# EAGLE design 9DOF-Razor-v22 (EAGLE 6.1)

## Sheet 1 of 2
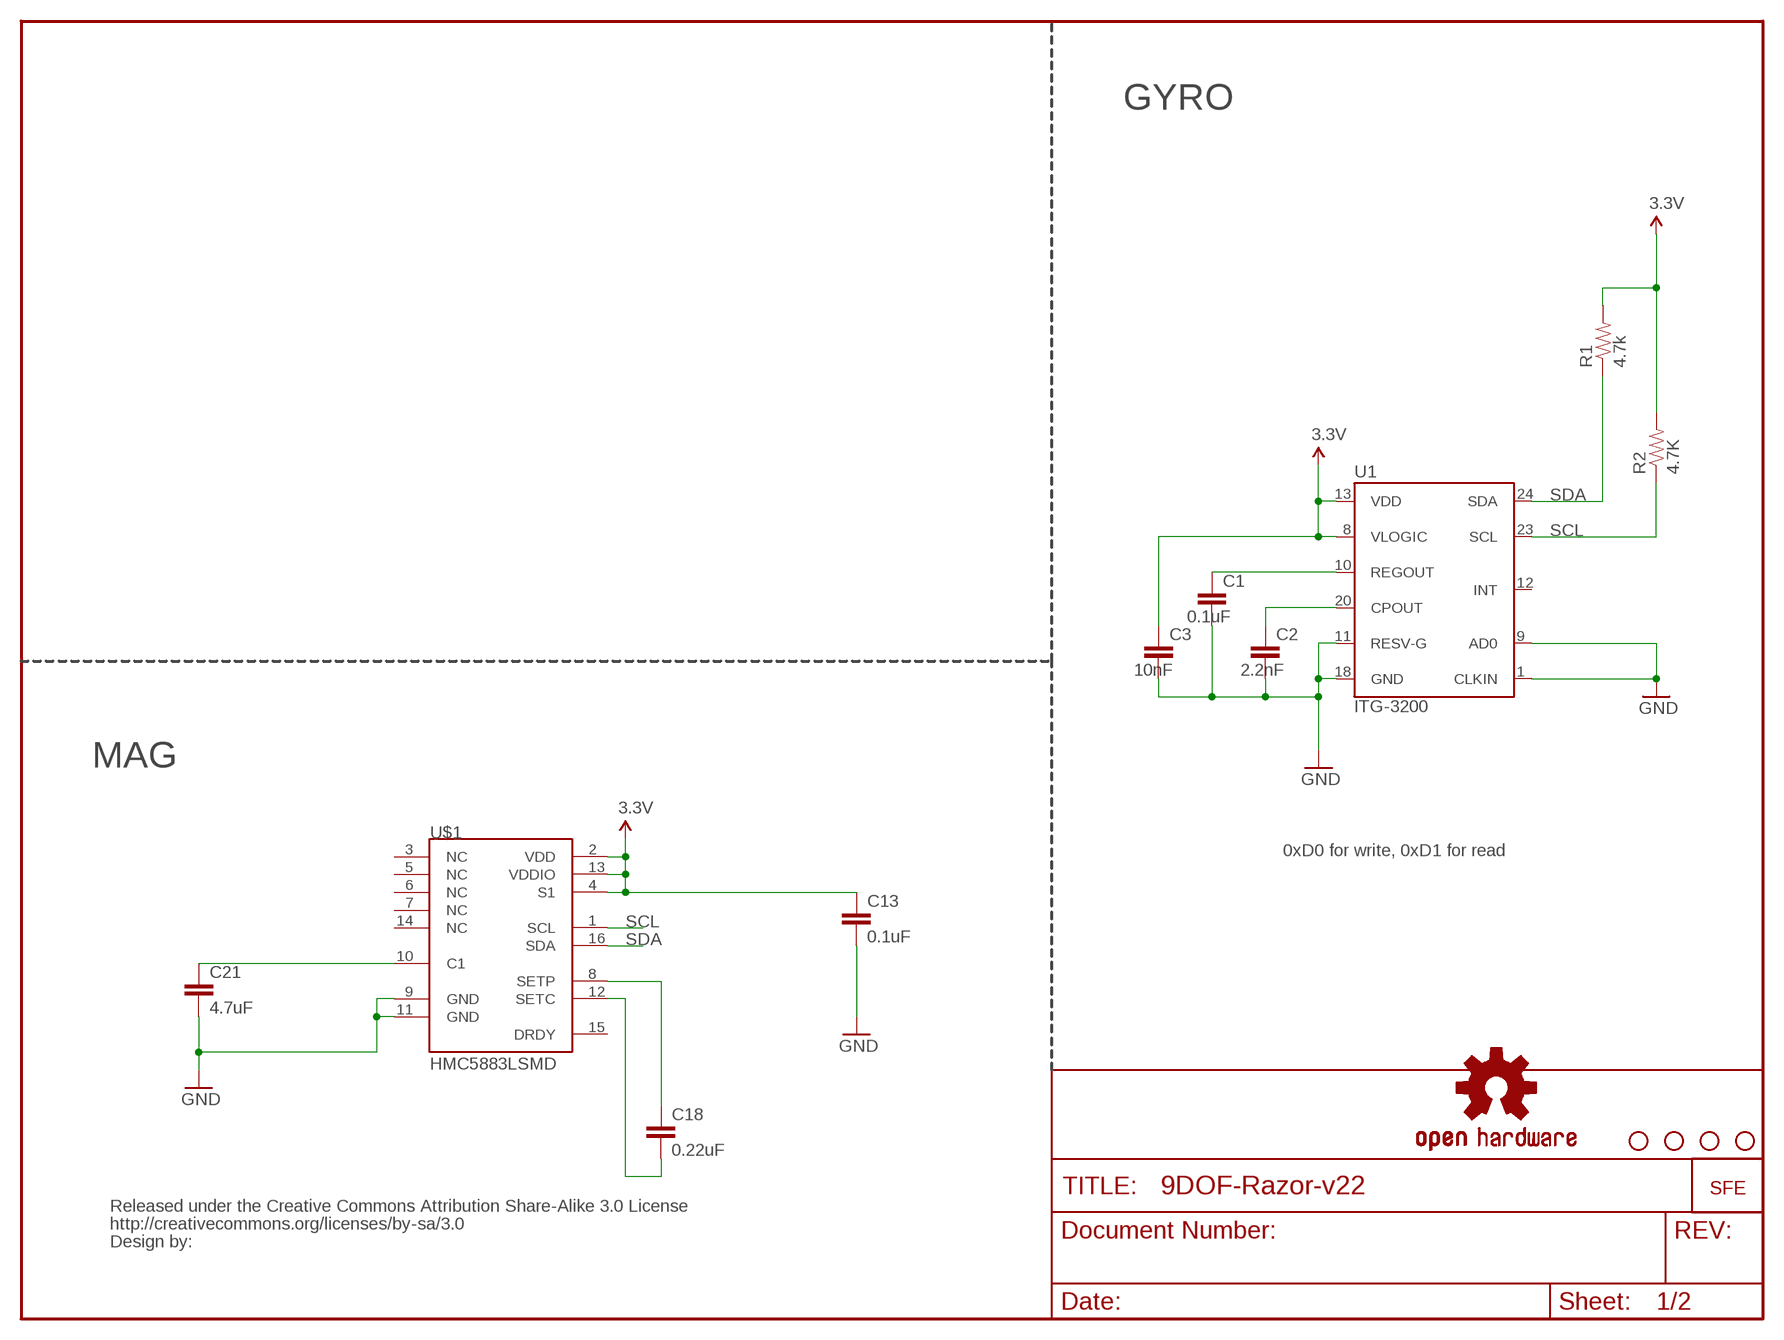
[diagram p0: schematic, sheet 1]

### Parts
C1  0.1uF  CAP0402-CAP  [0402-CAP]
C2  2.2nF  CAP0402-CAP  [0402-CAP]
C3  10nF  CAP0402-CAP  [0402-CAP]
C13  0.1uF  CAP0402-CAP  [0402-CAP]
C18  0.22uF  CAP0402-CAP  [0402-CAP]
C21  4.7uF  CAP0402-CAP  [0402-CAP]
JP2  STAND-OFF  [STAND-OFF]
JP3  LOGO-SFENEW  [SFE-NEW-WEBLOGO]
JP4  STAND-OFF  [STAND-OFF]
JP5  STAND-OFF  [STAND-OFF]
JP6  STAND-OFF  [STAND-OFF]
R1  4.7k  RESISTOR0402-RES  [0402-RES]
R2  4.7K  RESISTOR0402-RES  [0402-RES]
U1  ITG-3200  [QFN-24]
U$1  HMC5883LSMD  [16LPCC]
U$2  CREATIVE_COMMONS  [CREATIVE_COMMONS]
U$4  OSHW-LOGOL  [OSHW-LOGO-L]

### Nets
3.3V: C3.1 C13.1 R1.2 R2.2 U1.8(VLOGIC) U1.13(VDD) U$1.2(VDD) U$1.4(S1) U$1.13(VDDIO) ; also sheet 2
GND: C1.2 C2.2 C3.2 C13.2 C21.2 U1.1(CLKIN) U1.9(AD0) U1.11(RESV-G) U1.18(GND) U$1.9(GND) U$1.11(GND) ; also sheet 2
N$1: C18.2 U$1.8(SETP)
N$2: C18.1 U$1.12(SETC)
N$3: C1.1 U1.10(REGOUT)
N$4: C2.1 U1.20(CPOUT)
N$6: C21.1 U$1.10(C1)
SCL: R2.1 U1.23(SCL) U$1.1(SCL) ; also sheet 2
SDA: R1.1 U1.24(SDA) U$1.16(SDA) ; also sheet 2
Unconnected: U1.12(INT) U$1.3(NC) U$1.5(NC) U$1.6(NC) U$1.7(NC) U$1.14(NC) U$1.15(DRDY)

### Notes on the sheet
- GYRO
- MAG
- 0xD0 for write, 0xD1 for read

## Sheet 2 of 2
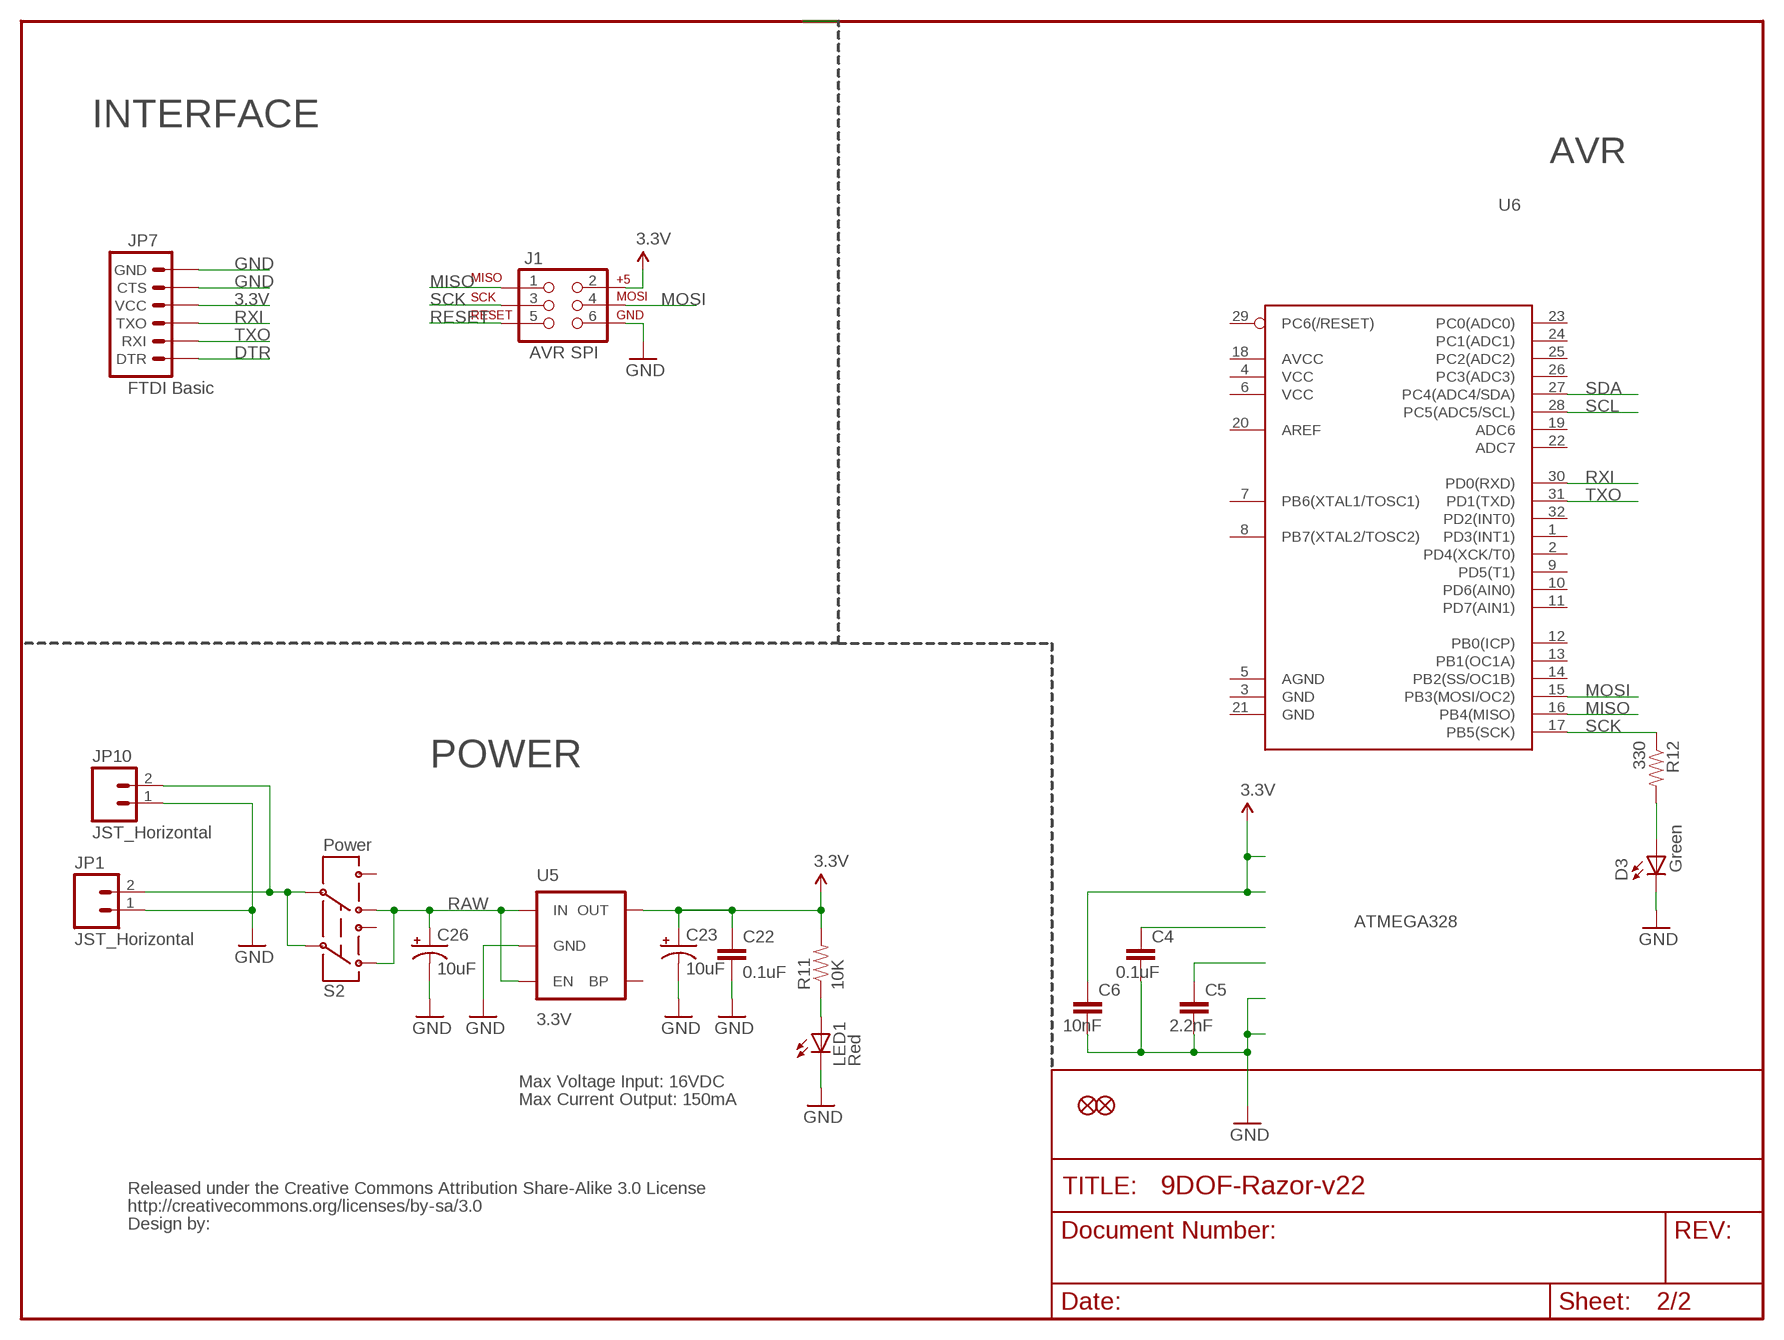
[diagram p1: schematic, sheet 2]

### Parts
C4  0.1uF  CAP0402-CAP  [0402-CAP]
C5  2.2nF  CAP0402-CAP  [0402-CAP]
C6  10nF  CAP0402-CAP  [0402-CAP]
C22  0.1uF  CAP0402-CAP  [0402-CAP]
C23  10uF  CAP_POL1206  [EIA3216]
C26  10uF  CAP_POL1206  [EIA3216]
D3  Green  LED0603  [LED-0603]
J1  AVR_SPI_PRG_6PTH  [2X3]
JP1  JST_Horizontal  M02-JST-2MM-SMT  [JST-2-SMD]
JP7  FTDI Basic  ARDUINO_SERIAL_PROGRAMPTH  [1X06]
JP10  JST_Horizontal  M02PTH  [1X02]
JP11  FIDUCIAL1X2.5  [FIDUCIAL-1X2.5]
JP12  FIDUCIAL1X2.5  [FIDUCIAL-1X2.5]
LED1  Red  LED0603  [LED-0603]
R11  10K  RESISTOR0402-RES  [0402-RES]
R12  330  RESISTOR0402-RES  [0402-RES]
S2  Power  SWITCH-DPDTSMD  [AYZ0202]
U5  3.3V  V_REG_LDOSMD  [SOT23-5]
U6  ATMEGA328  ATMEGA168  [TQFP32-08]
U$3  CREATIVE_COMMONS  [CREATIVE_COMMONS]

### Nets
3.3V: C6.1 C22.1 C23.A(+) J1.2 JP7.4(VCC) R11.2 U5.5(OUT) ; also sheet 1
DTR: JP7.1(DTR)
GND: C4.2 C5.2 C6.2 C22.2 C23.C(-) C26.C(-) D3.C J1.6 JP1.1 JP7.5(CTS) JP7.6(GND) JP10.1 LED1.C U5.2(GND) ; also sheet 1
MISO: J1.1 U6.16(PB4(MISO))
MOSI: J1.4 U6.15(PB3(MOSI/OC2))
N$5: C4.1
N$8: C5.1
N$12: D3.A R12.2
N$15: JP1.2 JP10.2 S2.2 S2.5
N$38: LED1.A R11.1
RAW [vcc]: C26.A(+) S2.1 S2.4 U5.1(IN) U5.3(EN)
RESET: J1.5
RXI: JP7.3(TXO) U6.30(PD0(RXD))
SCK: J1.3 R12.1 U6.17(PB5(SCK))
SCL: U6.28(PC5(ADC5/SCL)) ; also sheet 1
SDA: U6.27(PC4(ADC4/SDA)) ; also sheet 1
TXO: JP7.2(RXI) U6.31(PD1(TXD))
Unconnected: S2.3 S2.6 U5.4(BP) U6.1(PD3(INT1)) U6.2(PD4(XCK/T0)) U6.3(GND) U6.4(VCC) U6.5(AGND) U6.6(VCC) U6.7(PB6(XTAL1/TOSC1)) U6.8(PB7(XTAL2/TOSC2)) U6.9(PD5(T1)) U6.10(PD6(AIN0)) U6.11(PD7(AIN1)) U6.12(PB0(ICP)) U6.13(PB1(OC1A)) U6.14(PB2(SS/OC1B)) U6.18(AVCC) U6.19(ADC6) U6.20(AREF) U6.21(GND) U6.22(ADC7) U6.23(PC0(ADC0)) U6.24(PC1(ADC1)) U6.25(PC2(ADC2)) U6.26(PC3(ADC3)) U6.29(PC6(/RESET)) U6.32(PD2(INT0))

### Notes on the sheet
- INTERFACE
- AVR
- AVR SPI
- POWER
- Max Voltage Input: 16VDC
- Max Current Output: 150mA

## Library data of the parts
C1-C6 C13 C18 C21 C22 = SparkFun:CAP: Capacitor Standard 0603 ceramic capacitor, and 0.1" leaded capacitor.
C23 C26 = SparkFun:CAP_POL: Capacitor Polarized These are standard SMD and PTH capacitors. Normally 10uF, 47uF, and 100uF in electrolytic and tantalum varieties. Always verify the external diameter of the through hole cap, it varies with capacity, voltage, and manufacturer. The EIA devices should be standard.
D3 LED1 = SparkFun:LED: LEDs Standard schematic elements and footprints for 5mm, 3mm, 1206, and 0603 sized LEDs. 5mm - Spark Fun Electronics SKU : COM-00529 (and others)
J1 = SparkFun:AVR_SPI_PRG_6: AVR ISP 6 Pin This is the reduced ISP connector for AVR programming. Common on Arduino. This footprint will take up less PCB space and can be used with a 10-pin to 6-pin adapter such as SKU: BOB-08508
JP1 JP10 = SparkFun:M02: Header 2 Standard 2-pin 0.1" header. Use with straight break away headers (SKU : PRT-00116), right angle break away headers (PRT-00553), swiss pins (PRT-00743), machine pins (PRT-00117), and female headers (PRT-00115). Molex polarized connector foot print use with SKU : PRT-08233 with associated crimp pins and housings.
JP2 JP4-JP6 = SparkFun:STAND-OFF: Stand Off This is the mechanical footprint for a #4 phillips button head screw. Use the keepout ring to avoid running the screw head into surrounding components. SKU : PRT-00447
JP3 = SparkFun:LOGO-SFE: Spark Fun Electronics PCB Logo This is the standard Spark Fun Electronics PCB logo.
JP7 = SparkFun:ARDUINO_SERIAL_PROGRAM
JP11 JP12 = abes:FIDUCIAL: Fiducial Alignment Points Various fiducial points for machine vision alignment.
R1 R2 R11 R12 = SparkFun:RESISTOR: Resistor Basic schematic elements and footprints for 0603, 1206, and PTH resistors.
S2 = SparkFun:SWITCH-DPDT: DPDT Version of the COM-00597
U1 = SparkFun:ITG-3200: ITG-3200 3-axis gyro, digital output, qfn24 package
U5 = SparkFun:V_REG_LDO: Voltage Regulator LDO Standard 150mA LDO voltage regulator in SOT-23 layout. Micrel part MIC5205. BP (by-pass) pin is used to lower output noise with 470pF cap.
U6 = SparkFun:ATMEGA168
U$1 = SparkFun:HMC5883L: 3 Axis Digital Compass IC
U$2 U$3 = SparkFun:CREATIVE_COMMONS
U$4 = SparkFun:OSHW-LOGO: Open Source Hardware Logo This logo indicates the piece of hardware it is found on incorporates a OSHW license and/or adheres to the definition of open source hardware found here: http://freedomdefined.org/OSHW

## Net classes
1 vcc: width 0.254 mm

## Board
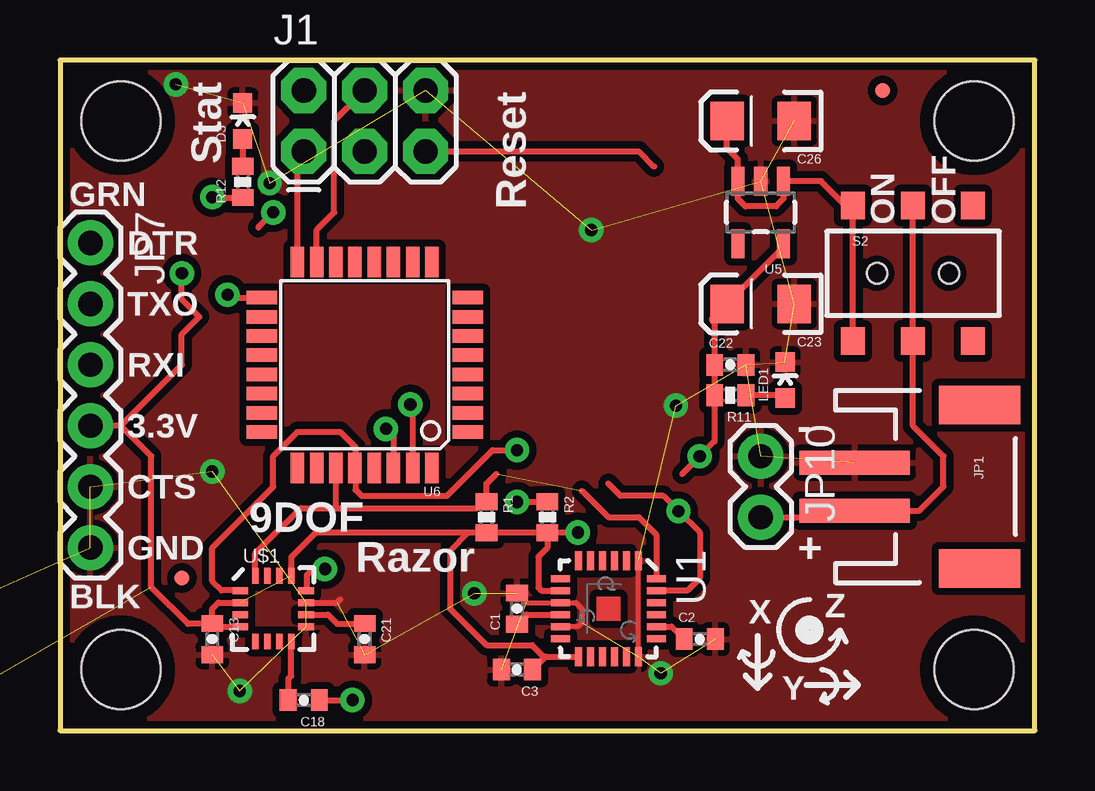
[diagram p2: board, top side]
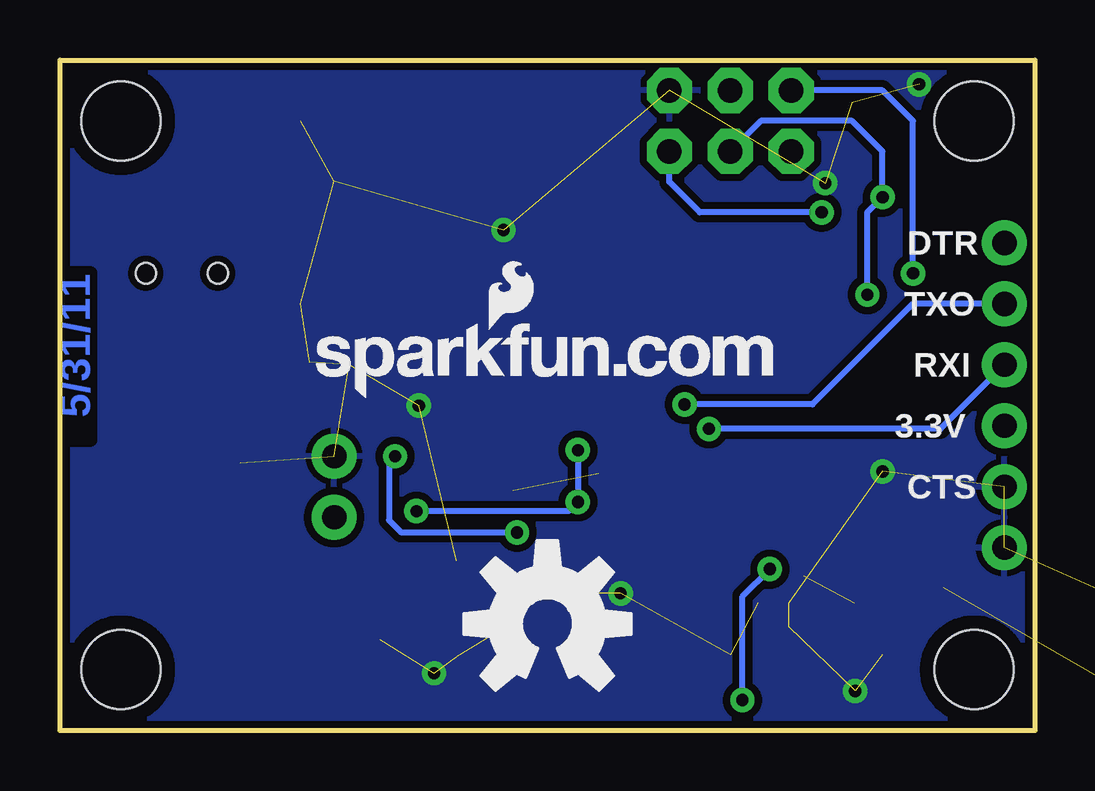
[diagram p3: board, bottom side, seen from below]

Size 40.64 x 27.94 mm. Coordinates in mm from the lower left corner, seen from the top.
Outline: 0,0 40.64,0 40.64,27.94 0,27.94 0,0
Copper layers (1*16): Top 0.035mm / dielectric 1.5mm / Bottom 0.035mm
Design rules: minimum track width 8mil, minimum drill 20mil, track to track 8mil, track to pad 8mil, pad to pad 8mil, via to via 8mil, smd to smd 8mil, copper to edge 8mil, drill to drill 8mil, minimum pad ring 12mil, minimum via ring 10mil, stop-mask expansion 4mil, vias tented up to drill 20mil, thermal gap 10mil

### Footprints (pad centres in the part's own frame; a part is rotated, then mirrored left to right if it is on the bottom)
0402-CAP = smd 0.7 x 0.9: 1 -0.65,0; 2 0.65,0
EIA3216 = smd 1.4 x 1.6: A 1.4,0; C -1.4,0
LED-0603 = smd 0.8 x 0.8: A 0,-0.75; C 0,0.75
2X3 = drill 1.016 pad 1.88 octagon: 1 0,0; 2 0,2.54; 3 2.54,0; 4 2.54,2.54; 5 5.08,0; 6 5.08,2.54
JST-2-SMD = smd 1 x 4.6: 1 -1,-3.7; 2 1,-3.7 | smd 1.6 x 3.4: NC1 -3.4,1.5; NC2 3.4,1.5
STAND-OFF = hole 3.302: 0,0
1X06 = drill 1.016 pad 1.88: 1 0,0; 2 2.54,0; 3 5.08,0; 4 7.62,0; 5 10.16,0; 6 12.7,0
1X02 = drill 1.016 pad 1.88: 1 0,0; 2 2.54,0
FIDUCIAL-1X2.5 = smd 0.635 x 0.635: 1 0,0
0402-RES = smd 0.7 x 0.9: 1 -0.65,0; 2 0.65,0
AYZ0202 = smd 1 x 1.15: 1 -2.5,2.825; 2 0,2.825; 3 2.5,2.825; 4 -2.5,-2.825; 5 0,-2.825; 6 2.5,-2.825 | hole 0.85: 1.5,0; -1.5,0
QFN-24 = smd 0.8 x 0.3: 1 -2,1.25; 2 -2,0.75; 3 -2,0.25; 4 -2,-0.25; 5 -2,-0.75; 6 -2,-1.25; 13 2,-1.25; 14 2,-0.75; 15 2,-0.25; 16 2,0.25; 17 2,0.75; 18 2,1.25 | smd 0.3 x 0.8: 7 -1.25,-2; 8 -0.75,-2; 9 -0.25,-2; 10 0.25,-2; 11 0.75,-2; 12 1.25,-2; 19 1.25,2; 20 0.75,2; 21 0.25,2; 22 -0.25,2; 23 -0.75,2; 24 -1.25,2
SOT23-5 = smd 0.55 x 1.2: 1 -0.95,-1.3; 2 0,-1.3; 3 0.95,-1.3; 4 0.95,1.3; 5 -0.95,1.3
TQFP32-08 = smd 1.27 x 0.559: 1 -4.293,2.8; 2 -4.293,2; 3 -4.293,1.2; 4 -4.293,0.4; 5 -4.293,-0.4; 6 -4.293,-1.2; 7 -4.293,-2; 8 -4.293,-2.8; 17 4.293,-2.8; 18 4.293,-2; 19 4.293,-1.2; 20 4.293,-0.4; 21 4.293,0.4; 22 4.293,1.2; 23 4.293,2; 24 4.293,2.8 | smd 0.559 x 1.27: 9 -2.8,-4.293; 10 -2,-4.293; 11 -1.2,-4.293; 12 -0.4,-4.293; 13 0.4,-4.293; 14 1.2,-4.293; 15 2,-4.293; 16 2.8,-4.293; 25 2.8,4.293; 26 2,4.293; 27 1.2,4.293; 28 0.4,4.293; 29 -0.4,4.293; 30 -1.2,4.293; 31 -2,4.293; 32 -2.8,4.293
16LPCC = smd 0.65 x 0.28: 1 -1.37,0.75; 2 -1.37,0.25; 3 -1.37,-0.25; 4 -1.37,-0.75; 9 1.37,-0.75; 10 1.37,-0.25; 11 1.37,0.25; 12 1.37,0.75 | smd 0.28 x 0.65: 5 -0.75,-1.37; 6 -0.25,-1.37; 7 0.25,-1.37; 8 0.75,-1.37; 13 0.75,1.37; 14 0.25,1.37; 15 -0.25,1.37; 16 -0.75,1.37

### Placement (x,y rotation side)
C1  19.05,5.08 90 top
C2  26.67,3.81 0 top
C3  19.05,2.54 180 top
C4  -27.94,-5.08 0 top  (outside the outline)
C5  -27.94,-8.89 0 top  (outside the outline)
C6  -27.94,-12.7 0 top  (outside the outline)
C13  6.35,3.81 270 top
C18  10.16,1.27 180 top
C21  12.7,3.81 270 top
C22  27.94,15.24 0 top
C23  29.21,17.78 180 top
C26  29.21,25.4 180 top
D3  7.62,25.4 0 top
J1  10.16,24.13 0 top
JP1  36.83,10.16 270 top
JP2  2.54,25.4 90 top
JP3  29.97,13.84 0 bottom
JP4  2.54,2.54 90 top
JP5  38.1,25.4 90 top
JP6  38.1,2.54 90 top
JP7  1.27,20.32 270 top
JP10  29.21,11.43 270 top
JP11  34.29,26.67 0 top
JP12  5.08,6.35 0 top
LED1  30.23,14.61 0 top
R1  17.78,8.89 270 top
R2  20.32,8.89 270 top
R11  27.94,13.97 180 top
R12  7.62,22.86 90 top
S2  35.56,19.05 0 top
U1  22.86,5.08 270 top
U5  29.21,21.59 180 top
U6  12.7,15.24 180 top
U$1  8.89,5.08 0 top
U$2  -8.89,22.86 0 top  (outside the outline)
U$3  -8.89,19.05 0 top  (outside the outline)
U$4  20.32,4.45 0 bottom

### Tracks (layer width: path | path; a pad name or v marks a point on that pad's centre or on a via)
3.3V  (via drill 0.51)  (2 unrouted)
  Top 0.254: 2.54,12.7 JP7.4 | 2.54,12.7 5.08,15.24 5.08,16.51 5.81,17.24 5.08,17.97 v5.08,19.05 | 25.94,10.7 v26.67,11.43 27.29,12.05 R11.2 C22.1 27.29,17 27.16,17.13 C23.A 30.16,20.13 U5.5 | R2.2 R1.2 17.02,8.24 | 20.24,3.08 U1.13 | 20.24,3.08 C3.1 | U1.8 20.08,5.83 19.94,5.97 19.94,7.24 20.32,7.62 R2.2 | 20.24,3.08 20.16,3.08 19.68,3.56 17.78,3.56 16.26,5.08 16.26,7.48 17.02,8.24 | R2.2 21.57,8.24 v21.59,8.26 | 2.54,12.7 3.81,11.43 3.81,5.97 5.33,4.45 6.33,4.45 C13.1 | U$1.13 9.64,7.23 10.65,8.24 17.02,8.24 | U$1.2 6.6,5.33 6.35,5.08 C13.1 | U$1.4 6.48,4.33 C13.1
  Bottom 0.254: J1.2 6.35,26.67 5.08,25.4 v5.08,19.05 | v21.59,8.26 26.42,8.26 26.92,8.76 26.92,11.18 v26.67,11.43
GND  (via drill 0.51)  (29 unrouted)
  Top 0.203: U1.18 U1.1 | C1.2 19.45,5.33 U1.9 21.52,5.33 21.77,5.08 21.77,4.5 21.6,4.33 U1.11
  Top 0.254: U$1.11 11.55,5.33 11.68,5.46
  other vias: 4.83,26.92 17.27,5.71 25.04,2.39 25.68,13.54 22.15,20.85 8.74,22.81 6.35,10.79 7.49,1.65
  pour Bottom (isolate 0.305): 0,27.94 0,0 40.64,0 40.64,27.94
  pour Top (isolate 0.305): 0,27.94 40.64,27.94 40.64,0 0,0
MISO
  Top 0.254: U6.16 9.9,23.87 J1.1
MOSI
  Top 0.254: U6.15 10.7,20.86 11.43,21.59 11.43,25.4 J1.4
N$1
  Top 0.254: U$1.8 9.64,2.27 9.53,2.16 9.53,1.28 C18.2
N$2  (via drill 0.51)
  Top 0.254: C18.1 v12.19,1.27 | v11.05,6.73 10.54,6.73 10.29,6.48 10.29,5.86 U$1.12
  Bottom 0.254: v12.19,1.27 12.19,5.59 v11.05,6.73
N$3
  Top 0.254: U1.10 19.45,4.83 C1.1
N$4
  Top 0.254: U1.20 25.5,4.33 C2.1
N$6
  Top 0.254: U$1.10 11.17,4.83 11.56,4.45 12.69,4.45 C21.1
N$12
  Top 0.254: D3.A R12.2
N$15
  Top 0.254: S2.2 S2.5 35.56,12.7 36.83,11.43 36.83,10.16 35.83,9.16 JP1.2 32.86,8.89 JP10.2
N$38
  Top 0.254: R11.1 30.11,13.97 LED1.A
RAW
  Top 0.254: C26.A 27.81,24.26 28.26,23.81 U5.3 28.26,22.16 28.57,21.84 29.84,21.84 30.16,22.16 U5.1 31.72,22.89 32.73,21.88 S2.1 S2.4
RESET  (via drill 0.51)
  Top 0.254: 24.77,23.5 24.13,24.13 J1.5 | 8.27,20.97 v8.89,21.59
  Bottom 0.254: v8.89,21.59 13.97,21.59 15.24,22.86 J1.5
RXI  (via drill 0.51)
  Top 0.254: U6.30 13.9,12.26 v13.59,12.57
  Bottom 0.254: v13.59,12.57 3.94,12.57 JP7.3
SCK  (via drill 0.51)
  Top 0.254: R12.1 6.37,22.21 v6.35,22.23 | U6.17 7.11,18.04 v6.99,18.16
  Bottom 0.254: J1.3 11.43,25.4 7.62,25.4 6.35,24.13 v6.35,22.23 6.99,21.59 v6.99,18.16
SCL  (via drill 0.51)
  Top 0.254: 12.32,10.97 12.32,11.81 11.68,12.45 9.91,12.45 8.89,11.43 8.89,10.16 6.35,7.62 6.35,6.22 6.73,5.84 7.51,5.84 U$1.1 | 12.32,10.97 U6.28 | U1.23 26.15,5.83 26.67,6.35 26.67,8.26 v25.78,9.14 25.15,9.78 23.37,9.78 22.86,10.29 | 12.32,10.97 12.32,10.03 12.57,9.78 16.13,9.78 18.03,11.68 v19.05,11.68 | R2.1 19.07,9.54 v19.05,9.53
  Bottom 0.254: v19.05,11.68 v19.05,9.53 19.43,9.14 v25.78,9.14
SDA  (1 unrouted)
  Top 0.254: 11.5,9.27 U6.27 | U1.24 24.86,8.16 24.13,8.89 22.86,8.89 21.76,9.99 | 18.19,10.7 17.78,10.29 R1.1 17.67,9.54 17.4,9.27 11.5,9.27 | 8.13,6.46 U$1.16 8.14,7.38 10.03,9.27 11.5,9.27
TXO  (via drill 0.51)
  Top 0.254: U6.31 14.7,13.49 v14.61,13.59
  Bottom 0.254: JP7.2 5.08,17.78 9.27,13.59 v14.61,13.59

### Text on the board
Bottom: 5/31/11
tPlace: Stat | GRN | Reset | ON | OFF | DTR | TXO | RXI | 3.3V | - | CTS | 9DOF | GND | Razor | + | BLK | Z | X | Y
bPlace: DTR | TXO | RXI | 3.3V | CTS